# EAGLE design board1 (EAGLE 9.6.2)
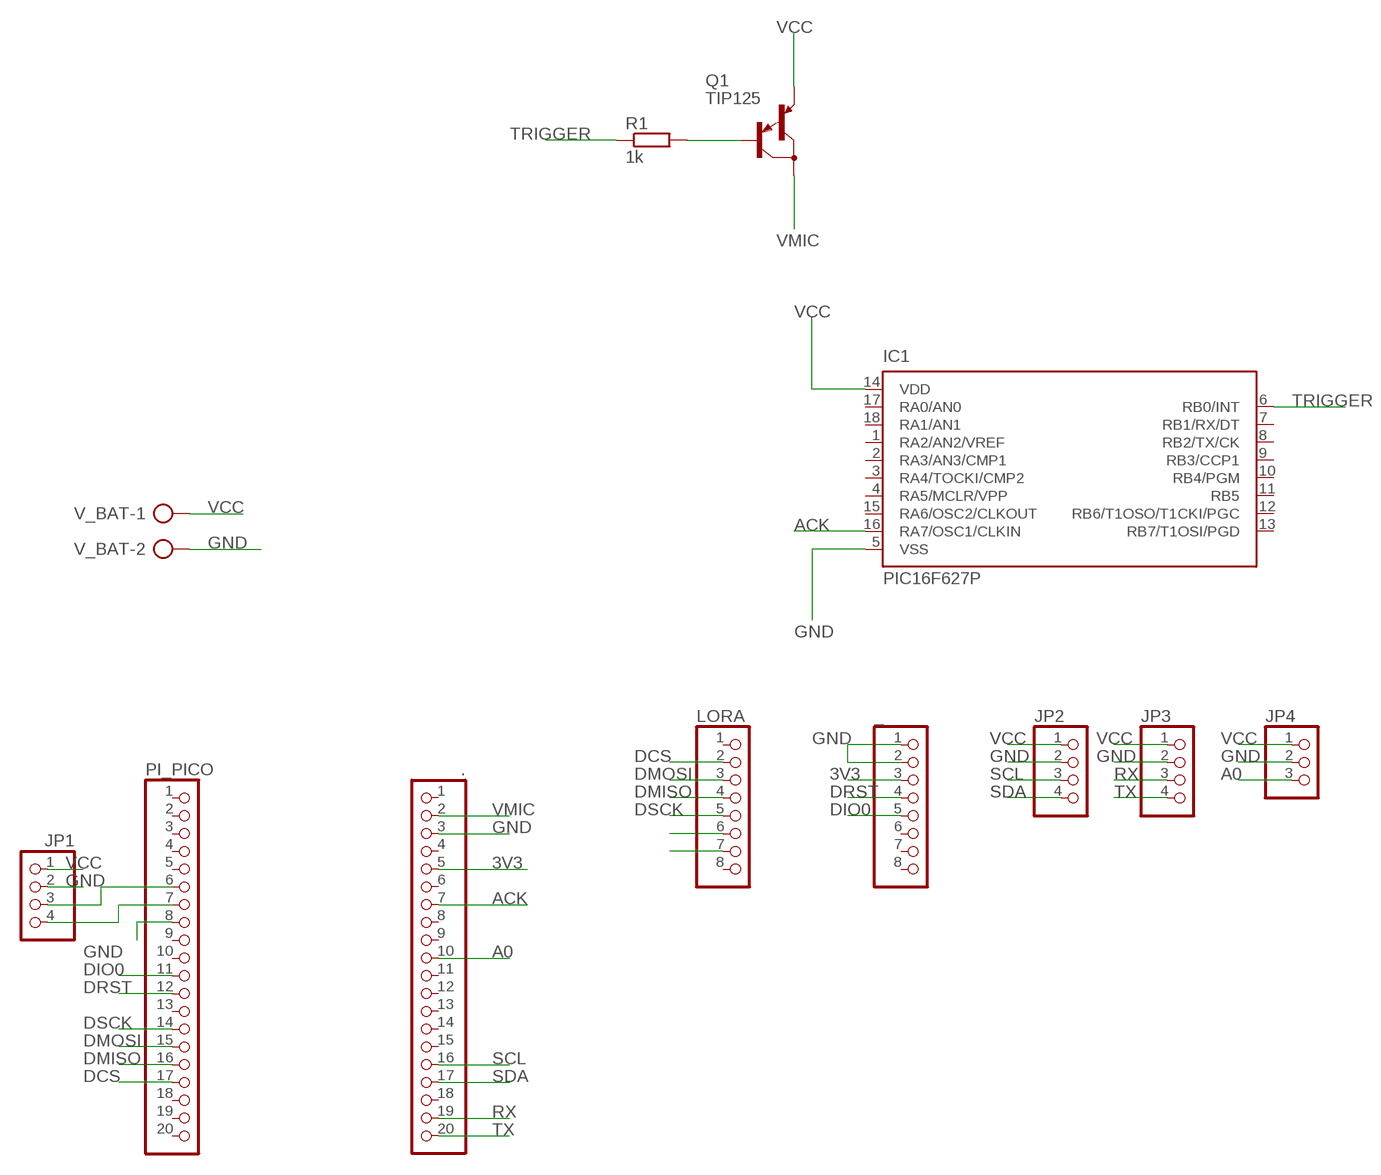
[diagram p0: schematic, sheet 1]

## Parts
.  PINHD-1X20  [1X20]
_  PINHD-1X8  [1X08]
IC1  PIC16F627P  [DIL18]
JP1  PINHD-1X4  [1X04]
JP2  PINHD-1X4  [1X04]
JP3  PINHD-1X4  [1X04]
JP4  PINHD-1X3  [1X03]
LORA  PINHD-1X8  [1X08]
PI_PICO  PINHD-1X20  [1X20]
Q1  TIP125  [TO220]
R1  1k  R-EU_0411/15  [0411/15]
V_BAT  AK500/2-H  [AK500/2-H]

## Nets
3V3: ..5 _.3
A0: ..10 JP4.3
ACK: ..7 IC1.16(RA7/OSC1/CLKIN)
DCS: LORA.2 PI_PICO.17
DIO0: _.5 PI_PICO.11
DMISO: LORA.4 PI_PICO.16
DMOSI: LORA.3 PI_PICO.15
DRST: _.4 PI_PICO.12
DSCK: LORA.5 PI_PICO.14
GND: ..3 _.1 _.2 IC1.5(VSS) JP1.2 JP2.2 JP3.2 JP4.2 PI_PICO.8 V_BAT.2
N$1: JP1.4 PI_PICO.7
N$2: JP1.3 PI_PICO.6
N$4: Q1.1(B) R1.2
N$10: LORA.6
N$11: LORA.7
RX: ..19 JP3.3
SCL: ..16 JP2.3
SDA: ..17 JP2.4
TRIGGER: IC1.6(RB0/INT) R1.1
TX: ..20 JP3.4
VCC: IC1.14(VDD) JP1.1 JP2.1 JP3.1 JP4.1 Q1.3(E) V_BAT.1
VMIC: ..2 Q1.2(C)
Unconnected: ..1 ..4 ..6 ..8 ..9 ..11 ..12 ..13 ..14 ..15 ..18 _.6 _.7 _.8 IC1.1(RA2/AN2/VREF) IC1.2(RA3/AN3/CMP1) IC1.3(RA4/TOCKI/CMP2) IC1.4(RA5/MCLR/VPP) IC1.7(RB1/RX/DT) IC1.8(RB2/TX/CK) IC1.9(RB3/CCP1) IC1.10(RB4/PGM) IC1.11(RB5) IC1.12(RB6/T1OSO/T1CKI/PGC) IC1.13(RB7/T1OSI/PGD) IC1.15(RA6/OSC2/CLKOUT) IC1.17(RA0/AN0) IC1.18(RA1/AN1) LORA.1 LORA.8 PI_PICO.1 PI_PICO.2 PI_PICO.3 PI_PICO.4 PI_PICO.5 PI_PICO.9 PI_PICO.10 PI_PICO.13 PI_PICO.18 PI_PICO.19 PI_PICO.20

## Library data of the parts
. PI_PICO = pinhead:PINHD-1X20: PIN HEADER
_ LORA = pinhead:PINHD-1X8: PIN HEADER
IC1 = microchip:PIC16F62*: FLASH-Based 8-Bit CMOS Microcontroller Source: http://ww1.microchip.com/downloads/en/DeviceDoc/40300C.pdf; MF: MICROCHIP; MPN: PIC16F627-04/P; OC_FARNELL: 1084298; OC_NEWARK: 23C4960
JP1-JP3 = pinhead:PINHD-1X4: PIN HEADER
JP4 = pinhead:PINHD-1X3: PIN HEADER
Q1 = transistor-pnp:TIP125: PNP Transistor
R1 = rcl:R-EU_: RESISTOR, European symbol; SPICEPREFIX: R
V_BAT = con-ptr500:AK500/2-H: CONNECTOR Aug. 2004 / PTR Meßtechnik: Die Bezeichnung der Serie AK505 wurde geändert. Es handelt sich hierbei um AK500 in horizontaler Ausführung.; OC_FARNELL: unknown; OC_NEWARK: unknown

## Board
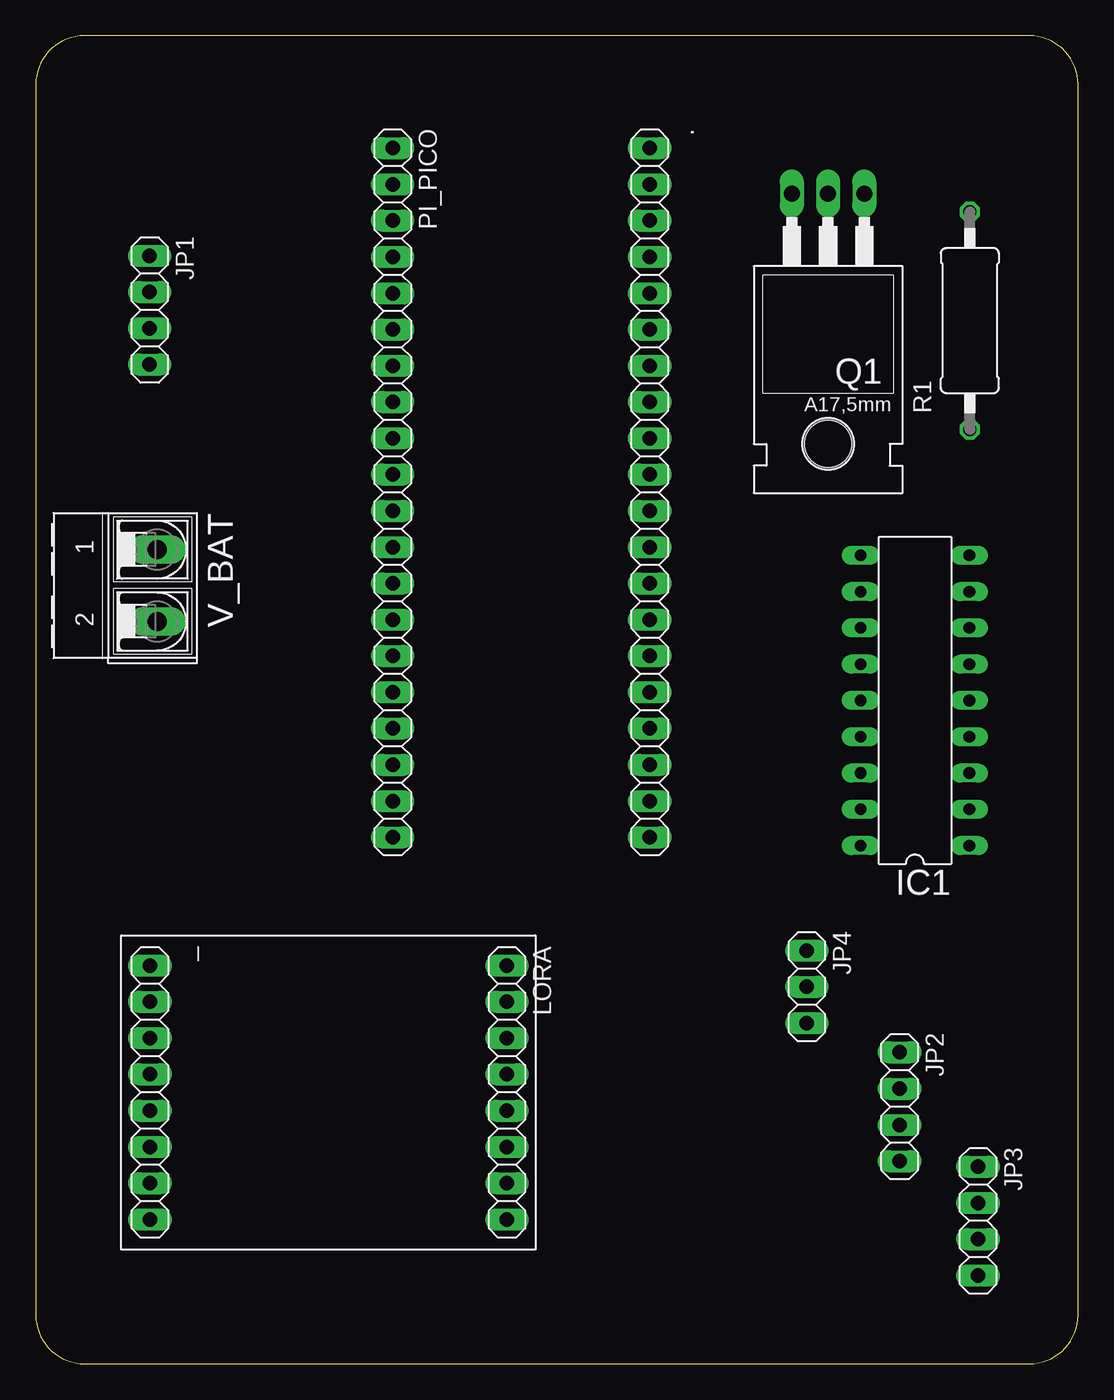
[diagram p1: board, top side]
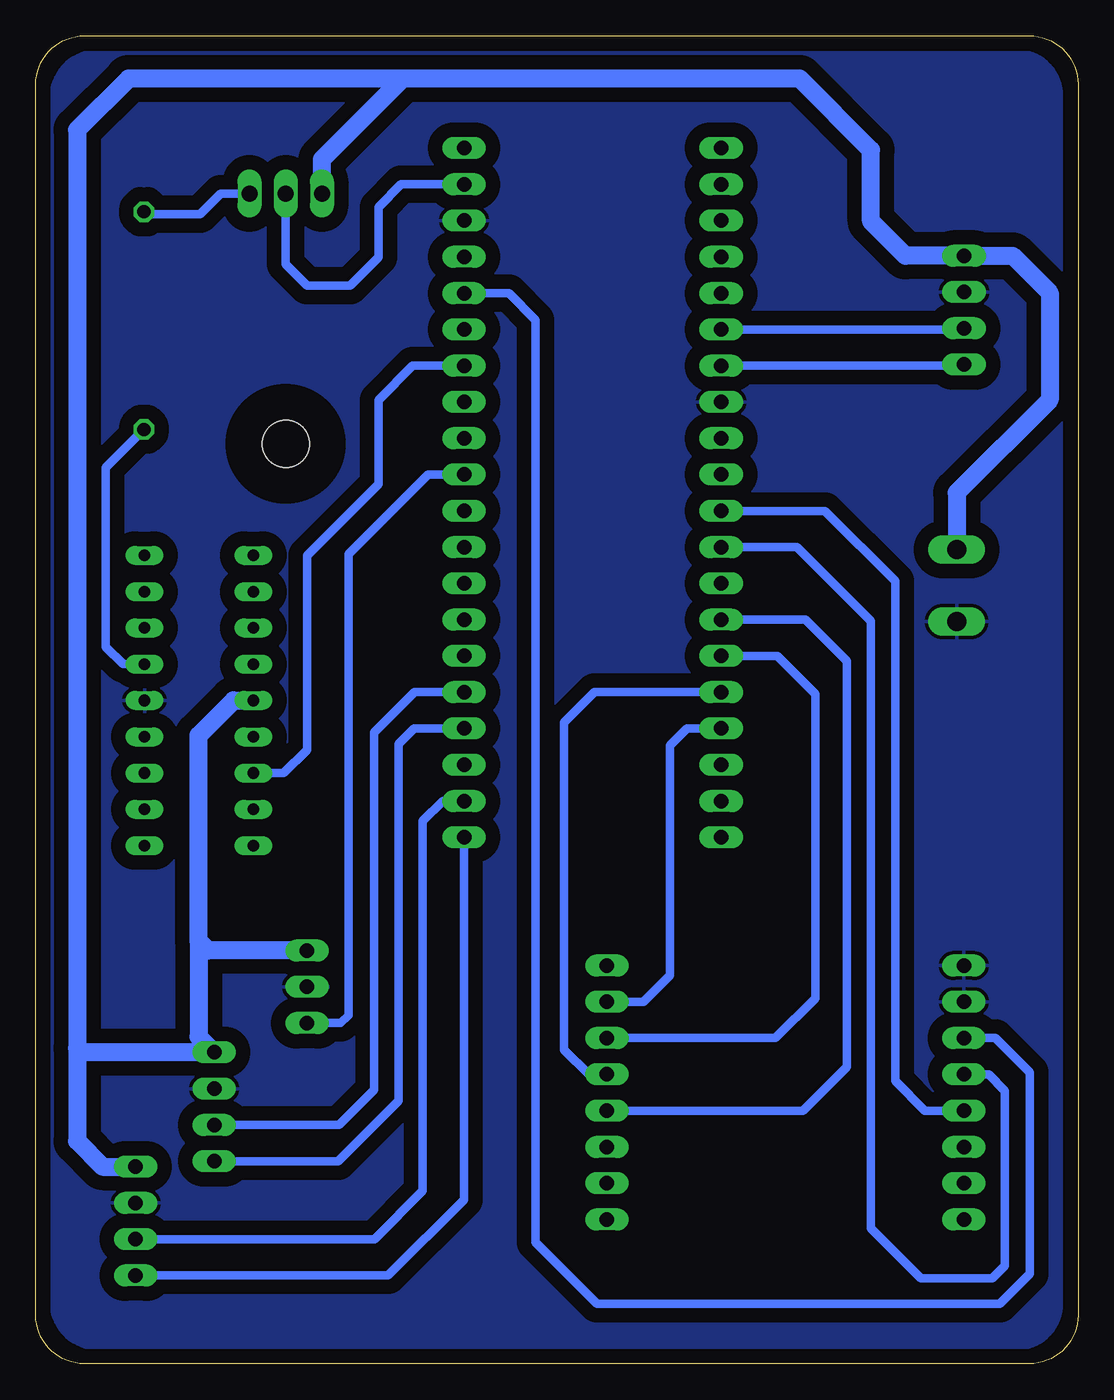
[diagram p2: board, bottom side, seen from below]

Size 73 x 93 mm. Coordinates in mm from the lower left corner, seen from the top.
Outline: 69.59,93 3.41,93 arc90 0,89.59 0,3.41 arc90 3.41,0 69.59,0 arc90 73,3.41 73,89.59 arc90 69.59,93
Copper layers (1*16): Top 0.035mm / dielectric 1.5mm / Bottom 0.035mm
Design rules "default *": minimum track width 6mil, minimum drill 0.35mm, track to track 40mil, track to pad 40mil, pad to pad 20mil, via to via 20mil, smd to smd 6mil, copper to edge 40mil, drill to drill 6mil, minimum pad ring 10mil, minimum via ring 8mil, stop-mask expansion 4mil, vias tented up to drill 0mil, thermal gap 10mil

### Footprints (pad centres in the part's own frame; a part is rotated, then mirrored left to right if it is on the bottom)
1X20 = drill 1.016 long: 1 -24.13,0; 2 -21.59,0; 3 -19.05,0; 4 -16.51,0; 5 -13.97,0; 6 -11.43,0; 7 -8.89,0; 8 -6.35,0; 9 -3.81,0; 10 -1.27,0; 11 1.27,0; 12 3.81,0; 13 6.35,0; 14 8.89,0; 15 11.43,0; 16 13.97,0; 17 16.51,0; 18 19.05,0; 19 21.59,0; 20 24.13,0
1X08 = drill 1.016 long: 1 -8.89,0; 2 -6.35,0; 3 -3.81,0; 4 -1.27,0; 5 1.27,0; 6 3.81,0; 7 6.35,0; 8 8.89,0
DIL18 = drill 0.813 long: 1 -10.16,-3.81; 2 -7.62,-3.81; 3 -5.08,-3.81; 4 -2.54,-3.81; 5 0,-3.81; 6 2.54,-3.81; 7 5.08,-3.81; 8 7.62,-3.81; 9 10.16,-3.81; 10 10.16,3.81; 11 7.62,3.81; 12 5.08,3.81; 13 2.54,3.81; 14 0,3.81; 15 -2.54,3.81; 16 -5.08,3.81; 17 -7.62,3.81; 18 -10.16,3.81
1X04 = drill 1.016 long: 1 -3.81,0; 2 -1.27,0; 3 1.27,0; 4 3.81,0
1X03 = drill 1.016 long: 1 -2.54,0; 2 0,0; 3 2.54,0
TO220 = drill 1.118 long: 1 -2.54,-6.35; 2 0,-6.35; 3 2.54,-6.35 | hole 3.302: 0,11.176
0411/15 = drill 0.914 octagon: 1 -7.62,0; 2 7.62,0
AK500/2-H = drill 1.321 long: 1 -2.515,0; 2 2.515,0

### Placement (x,y rotation side)
.  43,61 270 top
_  8,19 270 top
IC1  61.57,46.45 90 top
JP1  7.98,73.78 270 top
JP2  60.5,18 270 top
JP3  66,10 270 top
JP4  54,26.4 270 top
LORA  33,19 270 top
PI_PICO  25,61 270 top
Q1  55.49,75.59 180 top
R1  65.42,73.05 90 top
V_BAT  8.5,54.5 270 top

### Tracks (layer width: path | path; a pad name or v marks a point on that pad's centre or on a via)
3V3
  Bottom 0.61: _.3 5.81,22.81 3.4,20.4 3.4,6.3 5.5,4.2 33.7,4.2 38,8.5 38,73.1 39.87,74.97 ..5
A0
  Bottom 0.61: JP4.3 51.64,23.86 51.1,24.4 51.1,56.7 45.53,62.27 ..10
ACK
  Bottom 0.61: IC1.16 55.63,41.37 54,43 54,56.6 49,61.6 49,67.5 46.61,69.89 ..7
DCS
  Bottom 0.61: LORA.2 30.45,25.35 28.6,27.2 28.6,43.3 27.41,44.49 PI_PICO.17
DIO0
  Bottom 0.61: _.5 10.73,17.73 12.8,19.8 12.8,54.8 17.73,59.73 PI_PICO.11
DMISO
  Bottom 0.61: LORA.4 34.27,20.27 36,22 36,44.9 33.87,47.03 PI_PICO.16
DMOSI
  Bottom 0.61: PI_PICO.15 21.07,49.57 18.4,46.9 18.4,25.6 21.19,22.81 LORA.3
DRST
  Bottom 0.61: _.4 6.27,20.27 5.12,19.12 5.12,6.88 6,6 11,6 14.5,9.5 14.5,52 19.69,57.19 PI_PICO.12
DSCK
  Bottom 0.61: PI_PICO.14 19.11,52.11 16.2,49.2 16.2,20.8 19.27,17.73 LORA.5
GND
  pour Bottom: 1.1,4.24 1.1,88.76 arc-90 4.34,92 68.59,92 arc-90 72,88.59 72,4.41 arc-90 68.59,1 4.34,1 arc-90
N$1
  Bottom 0.61: JP1.4 8.06,69.89 PI_PICO.7
N$2
  Bottom 0.61: JP1.3 8.06,72.43 PI_PICO.6
N$4
  Bottom 0.61: Q1.1 60.06,81.94 61.5,80.5 65.25,80.5 R1.2
RX
  Bottom 0.61: JP3.3 49.27,8.73 45.9,12.1 45.9,38 44.49,39.41 ..19
SCL
  Bottom 0.61: JP2.3 51.77,16.73 49.3,19.2 49.3,44.2 46.47,47.03 ..16
SDA
  Bottom 0.61: JP2.4 51.81,14.19 47.6,18.4 47.6,43.4 46.51,44.49 ..17
TRIGGER
  Bottom 0.61: R1.1 68.1,62.75 68.1,50.2 66.89,48.99 IC1.6
TX
  Bottom 0.61: JP3.4 48.31,6.19 43,11.5 ..20
VCC
  Bottom 1.27: 47.3,90 19.5,90 14.5,85 14.5,80 12.09,77.59 JP1.1 4.59,77.59 2,75 2,67.5 8.5,61 V_BAT.1 | 47.3,90 66.5,90 70.1,86.4 70.1,22.1 | 70.1,22.1 70.1,15.6 68.31,13.81 JP3.1 | JP4.1 60.94,28.94 61.6,29.6 | 61.6,29.6 61.6,22.91 JP2.1 69.81,21.81 70.1,22.1 | IC1.14 59.15,46.45 61.6,44 61.6,29.6 | Q1.3 52.95,84.35 47.3,90
VMIC
  Bottom 0.61: Q1.2 55.5,77 54,75.5 51,75.5 49,77.5 49,81 47.41,82.59 ..2